# Altium project AI_PCB_PROJECT.PrjPcb
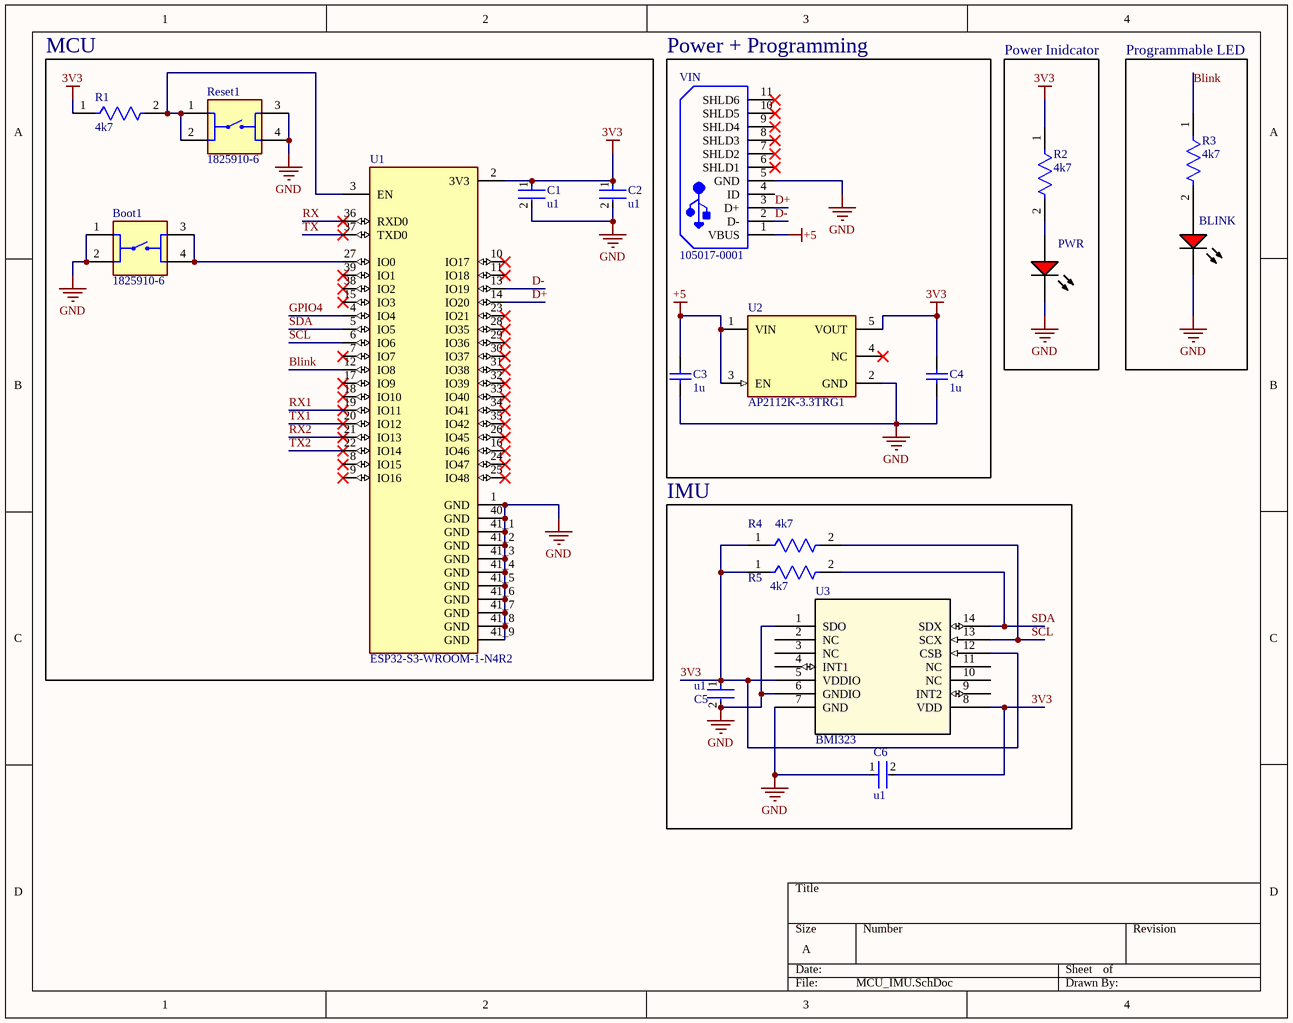
[diagram p0: MCU_IMU.SchDoc]
3 sheets, 96 parts. Net scope: global (net labels, ports and power ports of the same name join across sheets).
Board file: ROBOT_MOTHERBOARD.PcbDoc
Sheets:
  MCU_IMU.SchDoc
  UART_LOGIC.SchDoc
  Jetson_power.SchDoc

## Sheet MCU_IMU.SchDoc
size A; SheetNumber: 1; SheetTotal: 3

### Parts
BLINK  SML-LX1206IC-TR  [LUMX-SML-LX1206IC_V]  (value not drawn)
Boot1  1825910-6  [SW_1825910-6-4]
C1  u1  [FP-CC0805-0_85-MFG]
C2  u1  [FP-CC0805-0_85-MFG]
C3  1u  [CAPC2013X140X50ML20T25]
C4  1u  [CAPC2013X140X50ML20T25]
C5  u1  [FP-CC0805-0_85-MFG]
C6  u1  [FP-CC0805-0_85-MFG]
PWR  SML-LX1206IC-TR  [LUMX-SML-LX1206IC_V]  (value not drawn)
R1  4k7  [FP-CRCW0805-e3-IPC_B]
R2  4k7  [FP-CRCW0805-e3-IPC_B]
R3  4k7  [FP-CRCW0805-e3-IPC_B]
R4  4k7  [FP-CRCW0805-e3-IPC_B]
R5  4k7  [FP-CRCW0805-e3-IPC_B]
Reset1  1825910-6  [SW_1825910-6-4]
U1  ESP32-S3-WROOM-1-N4R2  [XCVR_ESP32-S3-WROOM-1-N4R2]
U2  AP2112K-3.3TRG1  [FP-SOT25-IPC_A]
U3  BMI323  [BMI323_BOS]
VIN  105017-0001  [USB-MICRO-B_V]

### Blocks framed on the sheet
MCU: Boot1 C1 C2 R1 Reset1 U1
Power + Programming: C3 C4 U2 VIN
Power Inidcator: PWR R2
Programmable LED: BLINK R3
IMU: C5 C6 R4 R5 U3

### Nets
3V3: C1.1 C2.1 C4.2 C5.1 C6.2 R1.1 R2.1 R4.1 R5.1 U1.2(3V3) U2.5(VOUT) U3.5(VDDIO) U3.8(VDD) U3.12(CSB)
+5: C3.2 U2.1(VIN) U2.3(EN) VIN.1(VBUS)
GND: BLINK.2(K) Boot1.1 Boot1.2 C1.2 C2.2 C3.1 C4.1 C5.2 C6.1 PWR.2(K) Reset1.3 Reset1.4 U1.1(GND) U1.40(GND) U1.41_1(GND) U1.41_2(GND) U1.41_3(GND) U1.41_4(GND) U1.41_5(GND) U1.41_6(GND) U1.41_7(GND) U1.41_8(GND) U1.41_9(GND) U2.2(GND) U3.1(SDO) U3.6(GNDIO) U3.7(GND) VIN.5(GND)
Blink: R3.1 U1.12(IO8)
D+: U1.14(IO20) VIN.3(D+)
D-: U1.13(IO19) VIN.2(D-)
GPIO4: U1.4(IO4)
RX: U1.36(RXD0)
RX1: U1.19(IO11)
RX2: U1.21(IO13)
SCL: R4.2 U1.6(IO6) U3.13(SCX)
SDA: R5.2 U1.5(IO5) U3.14(SDX)
TX: U1.37(TXD0)
TX1: U1.20(IO12)
TX2: U1.22(IO14)
NetBLINK_1: BLINK.1(A) R3.2
NetBoot1_3: Boot1.3 Boot1.4 U1.27(IO0)
NetPWR_1: PWR.1(A) R2.2
NetR1_2: R1.2 Reset1.1 Reset1.2 U1.3(EN)

Not connected (* = marked no-connect by the designer): U1 7(IO7)* 8(IO15)* 9(IO16)* 10(IO17)* 11(IO18)* 15(IO3)* 16(IO46)* 17(IO9)* 18(IO10)* 23(IO21)* 24(IO47)* 25(IO48)* 26(IO45)* 28(IO35)* 29(IO36)* 30(IO37)* 31(IO38)* 32(IO39)* 33(IO40)* 34(IO41)* 35(IO42)* 38(IO2)* 39(IO1)*; U2 4(NC)*; U3 2(NC) 3(NC) 4(INT1) 9(INT2) 10(NC) 11(NC); VIN 4(ID) 6(SHLD1)* 7(SHLD2)* 8(SHLD3)* 9(SHLD4)* 10(SHLD5)* 11(SHLD6)*

### Library data of the parts
BLINK PWR = CMP-2000-07123-1: LED Red, 65 mW, -40 to 85 degC, 2-Pin SMD, RoHS, Tape and Reel; Manufacturer: Lumex; LED Material: GaAsP; Peak Wavelength: 635nm; Number of LEDs: 1; Viewing Angle: 160; Reverse Voltage: 5(Min)V; Lens Appearance: ColorlessNonDiffused; Intensity: 6mcd; Pin_Count: 2; Lens Dimensions: 2x1.6x0.5mm; Mounting: SurfaceMount; ECCN: EAR99; RoHS: Unknown; Package Description: 2-Pin Surface Mount Device, Body 3.2 x 1.5 mm; Mounting Technology: SurfaceMount; Dominant Wavelength: N/A; Supplier_Package: SMD; Supplier Standard Pack: 3,000; Color: Red; Dimension: 3.2x1.6x1.1mm; HTS: 8541402000; Part No: SML-LX1206IC-TR; Family: SML-LX1206IC; Supplier: Lumex; Datasheet URL: http://www.lumex.com/content/files/ProductAttachment/SML-LX1206IC-TR.pdf; Package Reference: SML-LX1206IC; Manufacturer URL: http://www.lumexinstruments.com/; Type: Uni-Color; Operating Temperature: -25to85C; Packaging: TapeandReel; Datasheet Version: Rev. J, 08/2012
Boot1 Reset1 = 1825910-6: Switch Push Button OFF (ON) SPST Round Button 0.05A 24VDC Momentary Contact PC Pins Thru-Hole; MF: TE Connectivity; Value: *; MP: 1825910-6; Package: None; Check_prices: https://www.snapeda.com/parts/1825910-6/TE+Connectivity+ALCOSWITCH+Switches/view-part/?ref=eda; SnapEDA_Link: https://www.snapeda.com/parts/1825910-6/TE+Connectivity+ALCOSWITCH+Switches/view-part/?ref=snap; Digi-Key_Part_Number: 450-1650-ND; Purchase-URL: https://pricing.snapeda.com/search/part/1825910-6/?ref=eda
C1 C2 C5 C6 = CMP-2100-03606-3: CC0805KRX7R9BB104 CAP CER 0.1UF 50V X7R 0805; Manufacturer: Yageo; Tolerance: 0.1; Capacitance: 100 nF; Value: 100 nF; Material: Ceramic; Device Class L1: Passive Components; ComponentLink2Description: Datasheet; Package: CC0805-0.85; Manufacturer Part Number: CC0805KRX7R9BB104; Digikey Description: CAP CER 0.1UF 50V X7R 0805; Device Class L3: Ceramic Capacitors; Temperature: -30°C to +85°C; Temperature Characteristic: X7R; Voltage Rating: 50 V; Height: 0.95mm; RoHS: TRUE; Ipc Land Pattern Name: CAPC200125X85; Device Class L2: Capacitors; Category: Cap; Temperature Range Low: -30°C; Temperature Range High: +85°C; Mouser Description: Multilayer Ceramic Capacitors MLCC - SMD/SMT 100nF 50V X7R 10%; Footprint Url: http://www.yageo.com/exep/pages/download/literatures/UPY-C_GEN_24.pdf; Automotive: No; Octopart: https://octopart.com/cc0805krx7r9bb104-yageo-192993; Lead Free: Yes; ComponentLink2URL: http://www.yageo.com/documents/recent/UPY-GPHC_Y5V_6.3V-to-50V_8.pdf
C3 C4 = CMP-2007-03236-1: Manufacturer: Kemet; Part Number: C0805C105K5RACTU
R1-R5 = CMP-2100-03615-2: CRCW08054K70FKEARES Thick Film, 4.7kΩ, 1%, 0.125W, 100ppm/°C, 0805; Max Power Dissipation: 125mW; Resistance: 4.7kR; Voltage Rating: 150V; Termination: SMD/SMT; Weight: 0.000194oz; Case/Package: 0805; Number of Terminations: 2; Min Operating Temperature: -55°C; Case Code (Metric): 2012; Package Quantity: 10; Depth: 1.25mm; Military Standard: Not; Composition: Thick Film; Radiation Hardening: No; Contact Plating: Tin; Height: 0.45mm; Power Rating: 125mW; Features: Automotive AEC-Q200; Tolerance: 1%; Packaging: Tape and Reel; Max Operating Temperature: 155°C; Length: 2mm; Case Code (Imperial): 0805; Voltage Rating (DC): 150V; Width: 1.25mm; Temperature Coefficient: 100ppm/°C; Lead Free: Lead Free
U1 = ESP32-S3-WROOM-1-N4R2: Bluetooth, WiFi 802.11b/g/n, Bluetooth v5.0 Transceiver Module 2.4GHz PCB Trace Surface Mount; MF: Espressif Systems; Package: None; Purchase-URL: https://pricing.snapeda.com/search/part/ESP32-S3-WROOM-1-N4R2/?ref=eda; Price: None; Availability: In Stock; Check_prices: https://www.snapeda.com/parts/ESP32-S3-WROOM-1-N4R2/Espressif+Systems/view-part/?ref=eda; MP: ESP32-S3-WROOM-1-N4R2; SnapEDA_Link: https://www.snapeda.com/parts/ESP32-S3-WROOM-1-N4R2/Espressif+Systems/view-part/?ref=snap; Value: *
U2 = CMP-12756-000035-1: IC REG LINEAR 3.3V 600MA SOT25; Number of Regulators: 1; Output Type: Fixed; Polarity: Positive; Min Input Voltage: 2.5V; Max Input Voltage: 6V; Accuracy: 1.5%; Quiescent Current: 55uA; Dropout Voltage: 250mV; Min Operating Temperature: -40°C; Length: 3.1mm; Output Current: 600mA; Max Operating Temperature: 85°C; Package Quantity: 1; Output Voltage: 3.3V; Width: 1.7mm; Number of Outputs: 1; Packaging: Tape and Reel; Height: 1.3mm; Lead Free: Lead Free; Max Output Current: 600mA; Case/Package: SOT-23-5; Mount: Surface Mount; Number of Pins: 5
U3 = BMI323: No Description Available; Manufacturer_Name: Bosch Sensortec; Copyright: Copyright (C) 2025 Ultra Librarian. All rights reserved.; Manufacturer_Part_Number: BMI323; RefDes: RefDes; Type: Type
VIN = CMP-2000-05827-1: Micro-USB B Receptacle, Right Angle, Bottom Mount, Surface Mount, with Solder Tabs, -30 to 85 degC, 5-Pin USB, RoHS, Tape and Reel; Manufacturer: Molex; Featured Product: Micro-USBConnectorsUSBConnectors; Other Names: WM1399DKR; Package Version: Rev. F, 12/2012; Number of Contacts: 5; Connector Type: USB-microB; Catalog Drawings: 1050170001; 3D Model: 105017-0001.stp; Mating Products: WM17145-ND-CABLEMICROUSBBTOSTDA1.0MWM17147-ND-CABLEMICROUSBBTOSTDA2.0MWM17146-ND-CABLEMICROUSBBTOSTDA1.5M; PCN Assembly/Origin: ResinSupplier21/Oct/2015; Voltage - Max: 30V; Online Catalog: Molex-MicroUSB; Manufacturer URL: http://www.molex.com/; Package Description: 5-Leads USB, Micro B, Body 7.5 x 5 mm, Pitch 0.65 mm; Datasheet URL: http://www.molex.com/elqNow/elqRedir.htm?ref=http://www.molex.com/webdocs/datasheets/pdf/en-us/1050170001_IO_CONNECTORS.pdf; Ingress Protection: -; Datasheet Version: 03/2016; Mounting Type: BoardCutout,SurfaceMount,RightAngle; Circuits: 5; Standard Package: 1; Package Reference: MICRO-B; Package URL: http://www.molex.com/pdm_docs/sd/1050170001_sd.pdf; Category: Connectors,Interconnects; Series: -; RoHS Information: 1050170001CertofCompliance; Features: Shielded,SolderRetention; Family: USB,DVI,HDMIConnectors; Specifications: -; Gender: Receptacle; Packaging: Digi-Reel®; Mounting Technology: SurfaceMount

## Sheet UART_LOGIC.SchDoc
size A; SheetNumber: 2; SheetTotal: 3
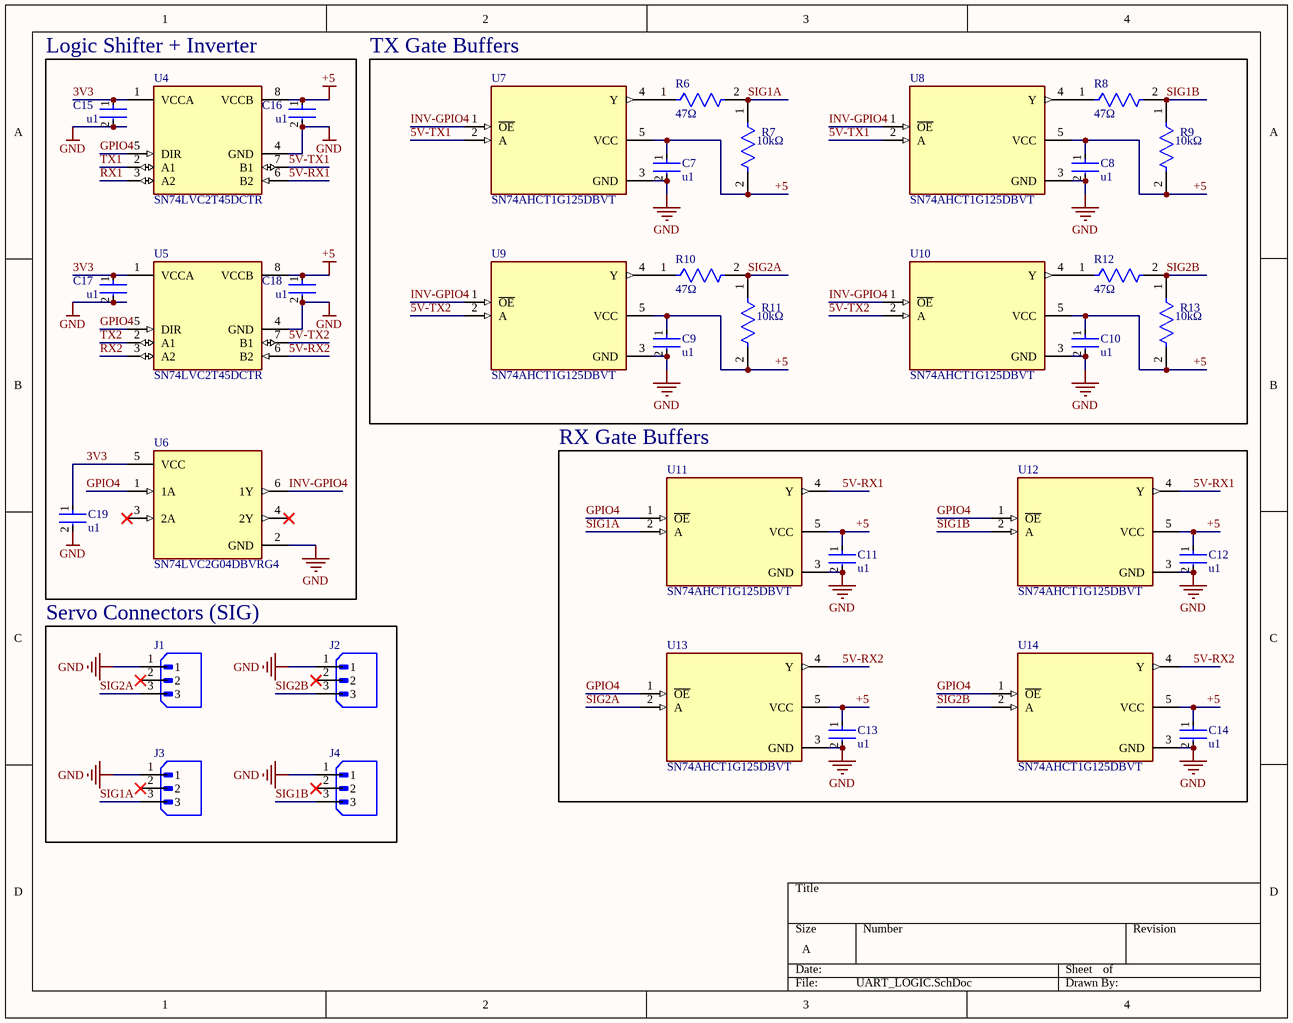
[diagram p1: UART_LOGIC.SchDoc]

### Parts
C7  u1  [FP-CC0805-0_85-MFG]
C8  u1  [FP-CC0805-0_85-MFG]
C9  u1  [FP-CC0805-0_85-MFG]
C10  u1  [FP-CC0805-0_85-MFG]
C11  u1  [FP-CC0805-0_85-MFG]
C12  u1  [FP-CC0805-0_85-MFG]
C13  u1  [FP-CC0805-0_85-MFG]
C14  u1  [FP-CC0805-0_85-MFG]
C15  u1  [FP-CC0805-0_85-MFG]
C16  u1  [FP-CC0805-0_85-MFG]
C17  u1  [FP-CC0805-0_85-MFG]
C18  u1  [FP-CC0805-0_85-MFG]
C19  u1  [FP-CC0805-0_85-MFG]
J1  B3B-XH-A  [JST_B3B-XH-A]  (value not drawn)
J2  B3B-XH-A  [JST_B3B-XH-A]  (value not drawn)
J3  B3B-XH-A  [JST_B3B-XH-A]  (value not drawn)
J4  B3B-XH-A  [JST_B3B-XH-A]  (value not drawn)
R6  47Ω  [FP-RMCF0603-IPC_A]
R7  10kΩ  [FP-RMCF1206-MFG]
R8  47Ω  [FP-RMCF0603-IPC_A]
R9  10kΩ  [FP-RMCF1206-MFG]
R10  47Ω  [FP-RMCF0603-IPC_A]
R11  10kΩ  [FP-RMCF1206-MFG]
R12  47Ω  [FP-RMCF0603-IPC_A]
R13  10kΩ  [FP-RMCF1206-MFG]
U4  SN74LVC2T45DCTR  [FP-DCT0008A-IPC_C]
U5  SN74LVC2T45DCTR  [FP-DCT0008A-IPC_C]
U6  SN74LVC2G04DBVRG4  [FP-DBV0006A-MFG]
U7  SN74AHCT1G125DBVT  [SOT95P280X145-5N]
U8  SN74AHCT1G125DBVT  [SOT95P280X145-5N]
U9  SN74AHCT1G125DBVT  [SOT95P280X145-5N]
U10  SN74AHCT1G125DBVT  [SOT95P280X145-5N]
U11  SN74AHCT1G125DBVT  [SOT95P280X145-5N]
U12  SN74AHCT1G125DBVT  [SOT95P280X145-5N]
U13  SN74AHCT1G125DBVT  [SOT95P280X145-5N]
U14  SN74AHCT1G125DBVT  [SOT95P280X145-5N]

### Blocks framed on the sheet
Logic Shifter + Inverter: C15-C19 U4-U6
TX Gate Buffers: C7-C10 R6-R13 U7-U10
RX Gate Buffers: C11-C14 U11-U14
Servo Connectors (SIG): J1-J4

### Nets
3V3: C15.1 C17.1 C19.1 U4.1(VCCA) U5.1(VCCA) U6.5(VCC)
+5: C7.1 C8.1 C9.1 C10.1 C11.1 C12.1 C13.1 C14.1 C16.1 C18.1 R7.2 R9.2 R11.2 R13.2 U4.8(VCCB) U5.8(VCCB) U7.5(VCC) U8.5(VCC) U9.5(VCC) U10.5(VCC) U11.5(VCC) U12.5(VCC) U13.5(VCC) U14.5(VCC)
GND: C7.2 C8.2 C9.2 C10.2 C11.2 C12.2 C13.2 C14.2 C15.2 C16.2 C17.2 C18.2 C19.2 J1.1 J2.1 J3.1 J4.1 U4.4(GND) U5.4(GND) U6.2(GND) U7.3(GND) U8.3(GND) U9.3(GND) U10.3(GND) U11.3(GND) U12.3(GND) U13.3(GND) U14.3(GND)
5V-RX1: U4.6(B2) U11.4(Y) U12.4(Y)
5V-RX2: U5.6(B2) U13.4(Y) U14.4(Y)
5V-TX1: U4.7(B1) U7.2(A) U8.2(A)
5V-TX2: U5.7(B1) U9.2(A) U10.2(A)
GPIO4: U4.5(DIR) U5.5(DIR) U6.1(1A) U11.1(~{OE}) U12.1(~{OE}) U13.1(~{OE}) U14.1(~{OE})
INV-GPIO4: U6.6(1Y) U7.1(~{OE}) U8.1(~{OE}) U9.1(~{OE}) U10.1(~{OE})
RX1: U4.3(A2)
RX2: U5.3(A2)
SIG1A: J3.3 R6.2 R7.1 U11.2(A)
SIG1B: J4.3 R8.2 R9.1 U12.2(A)
SIG2A: J1.3 R10.2 R11.1 U13.2(A)
SIG2B: J2.3 R12.2 R13.1 U14.2(A)
TX1: U4.2(A1)
TX2: U5.2(A1)
NetR6_1: R6.1 U7.4(Y)
NetR8_1: R8.1 U8.4(Y)
NetR10_1: R10.1 U9.4(Y)
NetR12_1: R12.1 U10.4(Y)

Not connected (* = marked no-connect by the designer): J1 2*; J2 2*; J3 2*; J4 2*; U6 3(2A)* 4(2Y)*

### Library data of the parts
C7-C19 = CMP-2100-03606-3: as C1 on sheet MCU_IMU; Device Class L1: Passive Components; ComponentLink2Description: Datasheet; Package: CC0805-0.85; Manufacturer Part Number: CC0805KRX7R9BB104; Digikey Description: CAP CER 0.1UF 50V X7R 0805; Device Class L3: Ceramic Capacitors; Temperature: -30°C to +85°C; Temperature Characteristic: X7R; Voltage Rating: 50 V; Height: 0.95mm; RoHS: TRUE; Ipc Land Pattern Name: CAPC200125X85; Device Class L2: Capacitors; Category: Cap; Temperature Range Low: -30°C; Temperature Range High: +85°C; Mouser Description: Multilayer Ceramic Capacitors MLCC - SMD/SMT 100nF 50V X7R 10%; Footprint Url: http://www.yageo.com/exep/pages/download/literatures/UPY-C_GEN_24.pdf; Automotive: No; Octopart: https://octopart.com/cc0805krx7r9bb104-yageo-192993; Lead Free: Yes; ComponentLink2URL: http://www.yageo.com/documents/recent/UPY-GPHC_Y5V_6.3V-to-50V_8.pdf
J1-J4 = CMP-002-00071-1: Connector Header Through Hole 3 position 0.098 (2.50mm); MF: JST Sales; Case/Package: None; Pins: 3; SnapEDA_Link: https://www.snapeda.com/parts/B3B-XH-A/JST+Sales+America+Inc./view-part/?ref=snap; MP: B3B-XH-A; Component Type: Standard; Check_prices: https://www.snapeda.com/parts/B3B-XH-A/JST+Sales+America+Inc./view-part/?ref=eda; Source: B3B-XH-A.SchLib; Value: *; Design Item ID: B3B-XH-A
R6 R8 R10 R12 = CMP-26527-000678-1: 47Ω ±1% 0.1W 0603 Thick Film Chip Resistor AEC-Q200 compliant RMCF0603FG47R0; Power Rating: 100mW; Resistance: 47R; Case/Package: 0603; RoHS Compliant: Yes
R7 R9 R11 R13 = CMP-26527-002036-1: 10kΩ ±1% 0.25W 1206 Thick Film Chip Resistor AEC-Q200 compliant RMCF1206FG10K0; Max Power Dissipation: 250mW; Resistance: 10kR; Temperature Coefficient: 100ppm/°C; Construction: Rectangular; Contact Plating: Tin; Max Operating Temperature: 155°C; Features: Automotive AEC-Q200; Radiation Hardening: No; Military Standard: Not; RoHS Compliant: Yes; Length: 0.126inch; Number of Terminations: 2; Mount: Surface Mount; Case Code (Imperial): 1206; Case Code (Metric): 3216; Series: RMCF; Width: 0.063inch; Min Operating Temperature: -55°C; Height: 0.028inch; Resistor Type: Thick Film; Packaging: Tape and Reel; Tolerance: 1%; Depth: 1.6mm; Case/Package: 1206
U4 U5 = CMP-0000-1: 2-Bit Dual Supply Transceiver with Configurable Voltage-Level Shifting and 3-State Outputs 8-SSOP -40 to 85; Manufacturer Lifecycle Status: ACTIVE; High Level Output Current: -32mA; Low Level Output Current: 32mA; Min Supply Voltage: 1.65V; Max Junction Temperature (Tj): 150°C; Polarity: Non-Inverting; Max Supply Voltage: 5.5V; Turn-On Delay Time: 17.7ns; Number of Channels: 2; Quiescent Current: 3µA; Number of Circuits: 1; Direction: Bidirectional; Data Rate: 420Mbps; Logic Function: Transceiver, Translator; Output Current: 50mA; Propagation Delay: 45.2ns; Packaging: Cut Tape; Contact Plating: Gold; Min Operating Temperature: -40°C; Ambient Temperature Range High: 85°C; Max Operating Temperature: 85°C; Height: 1.3mm; Width: 2.8mm; RoHS: Compliant; REACH SVHC: No; Length: 2.95mm; Weight: 23.388357mg; Lifecycle Status: Production; Schedule B: 8542390000, 8542390000; Pins: 8; Lead Free: Lead Free; Number of Bits: 2; Radiation Hardening: No; Number of Inputs: 1; Number of Elements: 1; Number of Outputs: 1; Thickness: 1.29mm; Case/Package: SSOP
U6 = CMP-04903-000086-1: IC INVERTER 2CH 2-INP SOT23-6; Quiescent Current: 10uA; Number of Elements: 2; Propagation Delay: 3.7ns; Min Supply Voltage: 1.65V; High Level Output Current: -32mA; Max Supply Voltage: 5.5V; Low Level Output Current: 32mA; Operating Supply Voltage: 5V; Turn-On Delay Time: 8ns; Mount: Surface Mount; Min Operating Temperature: -40°C; Logic Function: Inverter; Lead Free: Lead Free; Number of Bits: 2; Number of Pins: 6; Radiation Hardening: No; Max Operating Temperature: 125°C; Number of Circuits: 2; Weight: 0.000557oz; Number of Inputs: 2; RoHS Compliant: Yes; Technology: CMOS; Packaging: Tape and Reel; Number of Gates: 2; Case/Package: SOT-23-6; Package Quantity: 3000; Series: 74LVC
U7-U14 = CMP-009-000000-3: Single 4.5-V to 5.5-V buffer with TTL-compatible CMOS inputs and 3-state outputs; MF: Texas Instruments; Pin Count: 5; Design Item ID: SN74AHCT1G125DBVT; Value: *; Source: SN74AHCT1G125DBVT.SchLib; Check_prices: https://www.snapeda.com/parts/SN74AHCT1G125DBVT/Texas+Instruments/view-part/?ref=eda; Package: SOT-23-5 Texas Instruments; MP: SN74AHCT1G125DBVT; Component Type: Standard; SnapEDA_Link: https://www.snapeda.com/parts/SN74AHCT1G125DBVT/Texas+Instruments/view-part/?ref=snap

## Sheet Jetson_power.SchDoc
size A; SheetNumber: 3; SheetTotal: 3
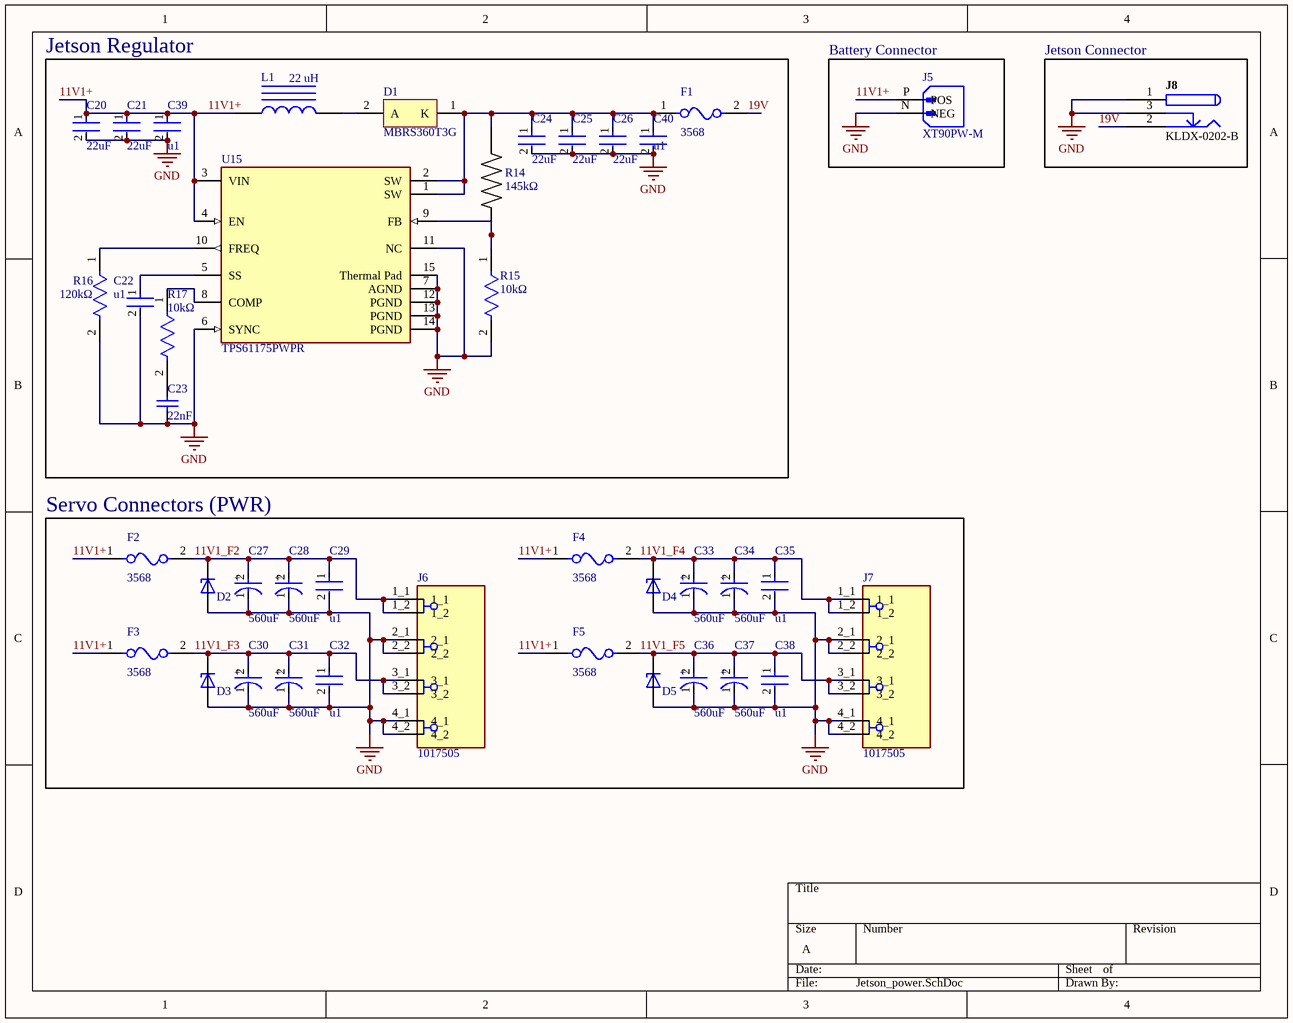
[diagram p2: Jetson_power.SchDoc]

### Parts
C20  22uF  [FP-CGA9P-MFG]
C21  22uF  [FP-CGA9P-MFG]
C22  u1  [FP-CC0805-0_85-MFG]
C23  22nF  [CAPC2013X94X50ML20T25]
C24  22uF  [FP-CGA9P-MFG]
C25  22uF  [FP-CGA9P-MFG]
C26  22uF  [FP-CGA9P-MFG]
C27  560uF  [FP-OS-CON-TH-E12-d_0_6-MFG]
C28  560uF  [FP-OS-CON-TH-E12-d_0_6-MFG]
C29  u1  [FP-CC0805-0_85-MFG]
C30  560uF  [FP-OS-CON-TH-E12-d_0_6-MFG]
C31  560uF  [FP-OS-CON-TH-E12-d_0_6-MFG]
C32  u1  [FP-CC0805-0_85-MFG]
C33  560uF  [FP-OS-CON-TH-E12-d_0_6-MFG]
C34  560uF  [FP-OS-CON-TH-E12-d_0_6-MFG]
C35  u1  [FP-CC0805-0_85-MFG]
C36  560uF  [FP-OS-CON-TH-E12-d_0_6-MFG]
C37  560uF  [FP-OS-CON-TH-E12-d_0_6-MFG]
C38  u1  [FP-CC0805-0_85-MFG]
C39  u1  [FP-CC0805-0_85-MFG]
C40  u1  [FP-CC0805-0_85-MFG]
D1  MBRS360T3G  [ONSC-SMC-2-403-03_V]
D2  SMBJ13A-13-F  [DIOM5336X250N]  (value not drawn)
D3  SMBJ13A-13-F  [DIOM5336X250N]  (value not drawn)
D4  SMBJ13A-13-F  [DIOM5336X250N]  (value not drawn)
D5  SMBJ13A-13-F  [DIOM5336X250N]  (value not drawn)
F1  3568  [FP-3568-MFG]
F2  3568  [FP-3568-MFG]
F3  3568  [FP-3568-MFG]
F4  3568  [FP-3568-MFG]
F5  3568  [FP-3568-MFG]
J5  XT90PW-M  [AMASS_XT90PW-M - duplicate]
J6  1017505  [PHOENIX_1017505]
J7  1017505  [PHOENIX_1017505]
J8  KLDX-0202-B  [KYCN-KLDX-0202-B_V]
L1  22 uH  [COIL-MSS1038_V]
R14  145kΩ  [*RESC2012X60N]
R15  10kΩ  [FP-RNCP0805-IPC_C]
R16  120kΩ  [FP-RMCF0603-IPC_A]
R17  10kΩ  [FP-RNCP0805-IPC_C]
U15  TPS61175PWPR  [FP-PWP0014E-MFG]

### Blocks framed on the sheet
Jetson Regulator: C20-C26 C39 C40 D1 F1 L1 R14-R17 U15
Battery Connector: J5
Jetson Connector: J8
Servo Connectors (PWR): C27-C38 D2-D5 F2-F5 J6 J7

### Nets
GND: C20.2 C21.2 C22.2 C23.1 C24.2 C25.2 C26.2 C27.1(C) C28.1(C) C29.2 C30.1(C) C31.1(C) C32.2 C33.1(C) C34.1(C) C35.2 C36.1(C) C37.1(C) C38.2 C39.2 C40.2 D2.2(A) D3.2(A) D4.2(A) D5.2(A) J5.N(NEG) J6.2_1 J6.2_2 J6.4_1 J6.4_2 J7.2_1 J7.2_2 J7.4_1 J7.4_2 J8.1 J8.3 R15.2 R16.2 U15.6(SYNC) U15.7(AGND) U15.11(NC) U15.12(PGND) U15.13(PGND) U15.14(PGND) U15.15(Thermal_Pad)
11V1+: C20.1 C21.1 C39.1 F2.1 F3.1 F4.1 F5.1 J5.P(POS) L1.1 U15.3(VIN) U15.4(EN)
11V1_F2: C27.2(A) C28.2(A) C29.1 D2.1(C) F2.2 J6.1_1 J6.1_2
11V1_F3: C30.2(A) C31.2(A) C32.1 D3.1(C) F3.2 J6.3_1 J6.3_2
11V1_F4: C33.2(A) C34.2(A) C35.1 D4.1(C) F4.2 J7.1_1 J7.1_2
11V1_F5: C36.2(A) C37.2(A) C38.1 D5.1(C) F5.2 J7.3_1 J7.3_2
19V: F1.2 J8.2
NetC22_1: C22.1 U15.5(SS)
NetC23_2: C23.2 R17.2
NetC24_1: C24.1 C25.1 C26.1 C40.1 D1.1(K) F1.1 R14.1 U15.1(SW) U15.2(SW)
NetD1_2: D1.2(A) L1.2
NetR14_2: R14.2 R15.1 U15.9(FB)
NetR16_1: R16.1 U15.10(FREQ)
NetR17_1: R17.1 U15.8(COMP)

### Notes on the sheet
- (in symbol CMP-05428-001250-1) +

### Library data of the parts
C20 C21 C24-C26 = CMP-08246-000043-1: CAP 2220 X7R 50V 22UF 20% 2.50MM CGA9P3X7R1H226M250KB
C22 C29 C32 C35 C38-C40 = CMP-2100-03606-3: as C1 on sheet MCU_IMU; Device Class L1: Passive Components; ComponentLink2Description: Datasheet; Package: CC0805-0.85; Manufacturer Part Number: CC0805KRX7R9BB104; Digikey Description: CAP CER 0.1UF 50V X7R 0805; Device Class L3: Ceramic Capacitors; Temperature: -30°C to +85°C; Temperature Characteristic: X7R; Voltage Rating: 50 V; Height: 0.95mm; RoHS: TRUE; Ipc Land Pattern Name: CAPC200125X85; Device Class L2: Capacitors; Category: Cap; Temperature Range Low: -30°C; Temperature Range High: +85°C; Mouser Description: Multilayer Ceramic Capacitors MLCC - SMD/SMT 100nF 50V X7R 10%; Footprint Url: http://www.yageo.com/exep/pages/download/literatures/UPY-C_GEN_24.pdf; Automotive: No; Octopart: https://octopart.com/cc0805krx7r9bb104-yageo-192993; Lead Free: Yes; ComponentLink2URL: http://www.yageo.com/documents/recent/UPY-GPHC_Y5V_6.3V-to-50V_8.pdf
C23 = CMP-2007-04398-1: 08055C223KAZ2A; Manufacturer: AVX Interconnect / Elco; Part Number: 08055C223KAZ2A
C27 C28 C30 C31 C33 C34 C36 C37 = CMP-05428-001250-1: Conductive Polymer Aluminum Solid Capacitors (OS-CON) 560uF ±20% 16V RADIAL TH 8x12mm 16SEPF560M; ESR (Equivalent Series Resistance): 14mR; Leakage Current: 1.792mA; Life (Hours): 5000Hour; Lead Diameter: 0.6mm; Dissipation Factor: 12%; Ripple Current: 4.95A; Polarity: Polar; RoHS Compliant: Yes; Length: 12mm; Series: OS-CON™, SEPF; Min Operating Temperature: -55°C; Construction: RADIAL; Tolerance: 20%; Capacitance: 560uF; Height: 12mm; Termination: Radial; Max Operating Temperature: 105°C; Number of Pins: 12; Diameter: 8mm; Lead Free: Lead Free; Lead Pitch: 3.5mm; Mount: Through Hole; Height - Seated (Max): 0.472inch; Package Quantity: 200; REACH SVHC: No SVHC; Voltage: 16V; Voltage Rating: 16V; Packaging: Bulk; Case/Package: Radial; Voltage Rating (DC): 16V
D1 = CMP-1055-00394-1: Schottky Power Rectifier, 2-Pin SMC, Pb-Free, Tape and Reel; Manufacturer: On Semiconductor; Configuration: Single; IFSM Max (A): 125; Packing: Tape and Reel; DatasheetVersion: Rev. 8; PackageReference: SMC-2-403-03; Mounting Technology: Surface Mount; ComponentLink2Description: Datasheet; ComponentLink2URL: http://www.onsemi.cn/pub_link/Collateral/MBRS360T3-D.PDF; PartNumber: MBRS360T3G; ComponentLink1Description: Manufacturer URL; ComponentLink3Description: Package Specification; PackageDescription: 2-Pin Small Molded Package, J-Bend Lead, Body 5.845 x 6.855 mm; ComponentLink1URL: http://www.onsemi.com/; PackageVersion: Rev. E, 08/2005; RoHS: TRUE; ComponentLink3URL: http://www.onsemi.com/pub_link/Collateral/403-03.PDF
D2-D5 = CMP-004-00032-1: 400 W 13 V Uni-Directional SMT Transient Voltage Suppressor Diode - DO-214AA; MF: Diodes Inc.; Component Type: Standard; Value: *; Case/Package: DO-214 Diodes Inc.; SnapEDA_Link: https://www.snapeda.com/parts/SMBJ13A-13-F/Diodes+Inc./view-part/?ref=snap; Check_prices: https://www.snapeda.com/parts/SMBJ13A-13-F/Diodes+Inc./view-part/?ref=eda; Design Item ID: SMBJ13A-13-F; Pins: 2; Source: SMBJ13A-13-F.SchLib; MP: SMBJ13A-13-F
F1-F5 = CMP-2000-05464-2: NexarPartId: 8116161; Approvals: UL; Body Material: Nylon; Illumination Type: Illuminated; Voltage Rating (AC): 500V; Current Rating: 20A; Number of Poles: 1; Color: Black; Material: Brass, Nylon, Tin; Depth: 6.73mm; Max Operating Temperature: 145°C; Length: 16mm; Mount: PCB, Vertical; REACH SVHC: No SVHC; Lead Free: Lead Free; Min Operating Temperature: -50°C; Flammability Rating: UL94 V-0; RoHS: Compliant; Orientation: Vertical; Fuse Current: 20A; Termination: PC Pin; Number of Circuits: 1; Contact Plating: Tin; Voltage: 500V; Contact Material: Brass
J5 = XT90PW-M: Socket; DC supply; XT90; male; PIN: 2; on PCBs; THT; Colour: yellow; MF: AMASS; SnapEDA_Link: https://www.snapeda.com/parts/XT90PW-M/AMASS/view-part/?ref=snap; Package: Package; Value: *; MP: XT90PW-M; Check_prices: https://www.snapeda.com/parts/XT90PW-M/AMASS/view-part/?ref=eda
J6 J7 = CMP-011-000000-2: MF: {'manufacturer': u'Phoenix Contact'}; Source: 1017505.SchLib; Price: None; MP: 1017505; Package: None; Component Type: Standard; Availability: Unavailable; Design Item ID: 1017505; Pin Count: 8; Value: *
J8 = CMP-0256-00001-1: 3 Conductor Power Jack, 2 break 2 aux contacts; ComponentLink2URL: http://anacapa.kycon.com/Catalog_PDF/KLDX_0202.pdf; PackageReference: KLDX-0202-B; Contact Finish: Brass; ComponentLink2Description: Datasheet; Mounting Technology: Through Hole; PackageDescription: Jack, 9 x 14.5 mm Body, 2.5 mm Center Pin Diameter; ComponentLink1Description: Manufacturer URL; PartNumber: KLDX-0202-B; ComponentLink1URL: http://kycon.com/
L1 = CMP-2000-06765-1: XAL7070; Case Length: 10.5mm; Shielding: Shielded; Maximum DC Resistance: 50mOhms; Core Material: Ferrite; Self Resonant Frequency: 21MHz; Tolerance: 20%; Test Frequency: 100kHz; Brand: Coilcraft; Case Height: 4mm; Maximum DC Current: 3.8A; Case Width: 10.2mm; Inductance: 15uH; Factory Pack Quantity: 250; Manufacturer URL: http://www.coilcraft.com/; Datasheet Version: 09/2016; Product: PowerInductors; Packaging: Reel; Product Category: FixedInductors; Package Description: 2-Pin Surface Mounted Device , Body 10 x 10 mm; RoHS: Details; Mounting Technology: SurfaceMount; Dimensions: 10.2mmWx10.5mmLx4mmH; Series: MSS1038; Termination Style: SMD/SMT; Datasheet URL: http://www.coilcraft.com/pdfs/mss1038.pdf; Manufacturer: Coilcraft; Package Reference: MSS1038; Operating Temperature Range: -40Cto+125C
R14 = RN73H2ATTD1453B25: SnapEDA_Link: https://www.snapeda.com/parts/RN73H2ATTD1453B25/KOA+Speer/view-part/?ref=snap; Check_prices: https://www.snapeda.com/parts/RN73H2ATTD1453B25/KOA+Speer/view-part/?ref=eda; Value: *
R15 R17 = CMP-26527-007436-1: 10kΩ ±1% 0.25W 0805 High Power Anti-Sulfur Thin Film Chip Resistor RNCP0805FTD10K0; Resistance: 10kR; Max Power Dissipation: 250mW; Temperature Coefficient: 100ppm/°C; Number of Terminations: 2; Length: 0.079inch; Case Code (Metric): 2012; Mount: Surface Mount; Resistor Type: Thin Film; Packaging: Tape and Reel; Tolerance: 1%; RoHS Compliant: Yes; Case Code (Imperial): 0805; Min Operating Temperature: -55°C; Max Operating Temperature: 155°C; Features: Moisture Resistant; Series: RNCP; Case/Package: 0805; Width: 0.049inch; Lead Free: Lead Free; Height: 0.024inch
R16 = CMP-26527-001149-1: 120kΩ ±1% 0.1W 0603 Thick Film Chip Resistor AEC-Q200 compliant RMCF0603FG120K; Resistance: 120kR; Temperature Coefficient: 100ppm/°C; Radiation Hardening: No; Tolerance: 1%; Mount: Surface Mount; Min Operating Temperature: -55°C; Max Operating Temperature: 155°C; Packaging: Tape and Reel; Contact Plating: Tin; Resistor Type: Thick Film; Case/Package: 0603
U15 = CMP-04918-000064-1: IC REG MULT CONFIG ADJ 14HTSSOP; Manufacturer: Texas Instruments; Switching Frequency: 200-2200kHz; Nominal Supply Current: 3.5mA; Max Junction Temp: +125°C; Standoff Height: 0.05mm; Output Voltage: 2.9-38V; Min Supply Voltage: 2.9V; Output Current: 3A; Max Duty Cycle: 93%; Number Of Outputs: 1; Max Supply Voltage: 18V; Switching Topology: Boost,Flyback,Other; Output Type: AdjustableProgrammable; Mouser Description: Voltage Regulators - Switching Regulators 3A High Vltg Boost Converter; ComponentLink2URL: http://www.ti.com/lit/ds/symlink/tps61175.pdf; Ambient Temperature Range High: +85°C; Category: IC; Temperature Range High: +85°C; Automotive: No; Digikey Description: IC REG MULT CONFIG ADJ 14HTSSOP; Ambient Temperature Range Low: -40°C; ComponentLink2Description: Datasheet; Octopart: https://octopart.com/tps61175pwpr-texas+instruments-12190773; Manufacturer Part Number: TPS61175PWPR; Ipc Land Pattern Name: SOP65P500X120-14; Package: PWP0014E; Height: 1.2mm; Device Class L3: Voltage Regulators - Switching; Device Class L2: Power Management ICs; Temperature Range Low: -40°C; Temperature: -40°C to +85°C; Device Class L1: Integrated Circuits (ICs); Lead Free: Yes; RoHS: TRUE

## Nets that join several sheets
3V3: MCU_IMU (14 pins), UART_LOGIC (6 pins)
+5: MCU_IMU (C3.2 U2.1 U2.3 VIN.1), UART_LOGIC (24 pins)
GND: MCU_IMU (28 pins), UART_LOGIC (28 pins), Jetson_power (45 pins)
GPIO4: MCU_IMU (U1.4), UART_LOGIC (7 pins)
RX1: MCU_IMU (U1.19), UART_LOGIC (U4.3)
RX2: MCU_IMU (U1.21), UART_LOGIC (U5.3)
TX1: MCU_IMU (U1.20), UART_LOGIC (U4.2)
TX2: MCU_IMU (U1.22), UART_LOGIC (U5.2)